# Altium schematic sheet 05.SchDoc
size 297 x 209 mm
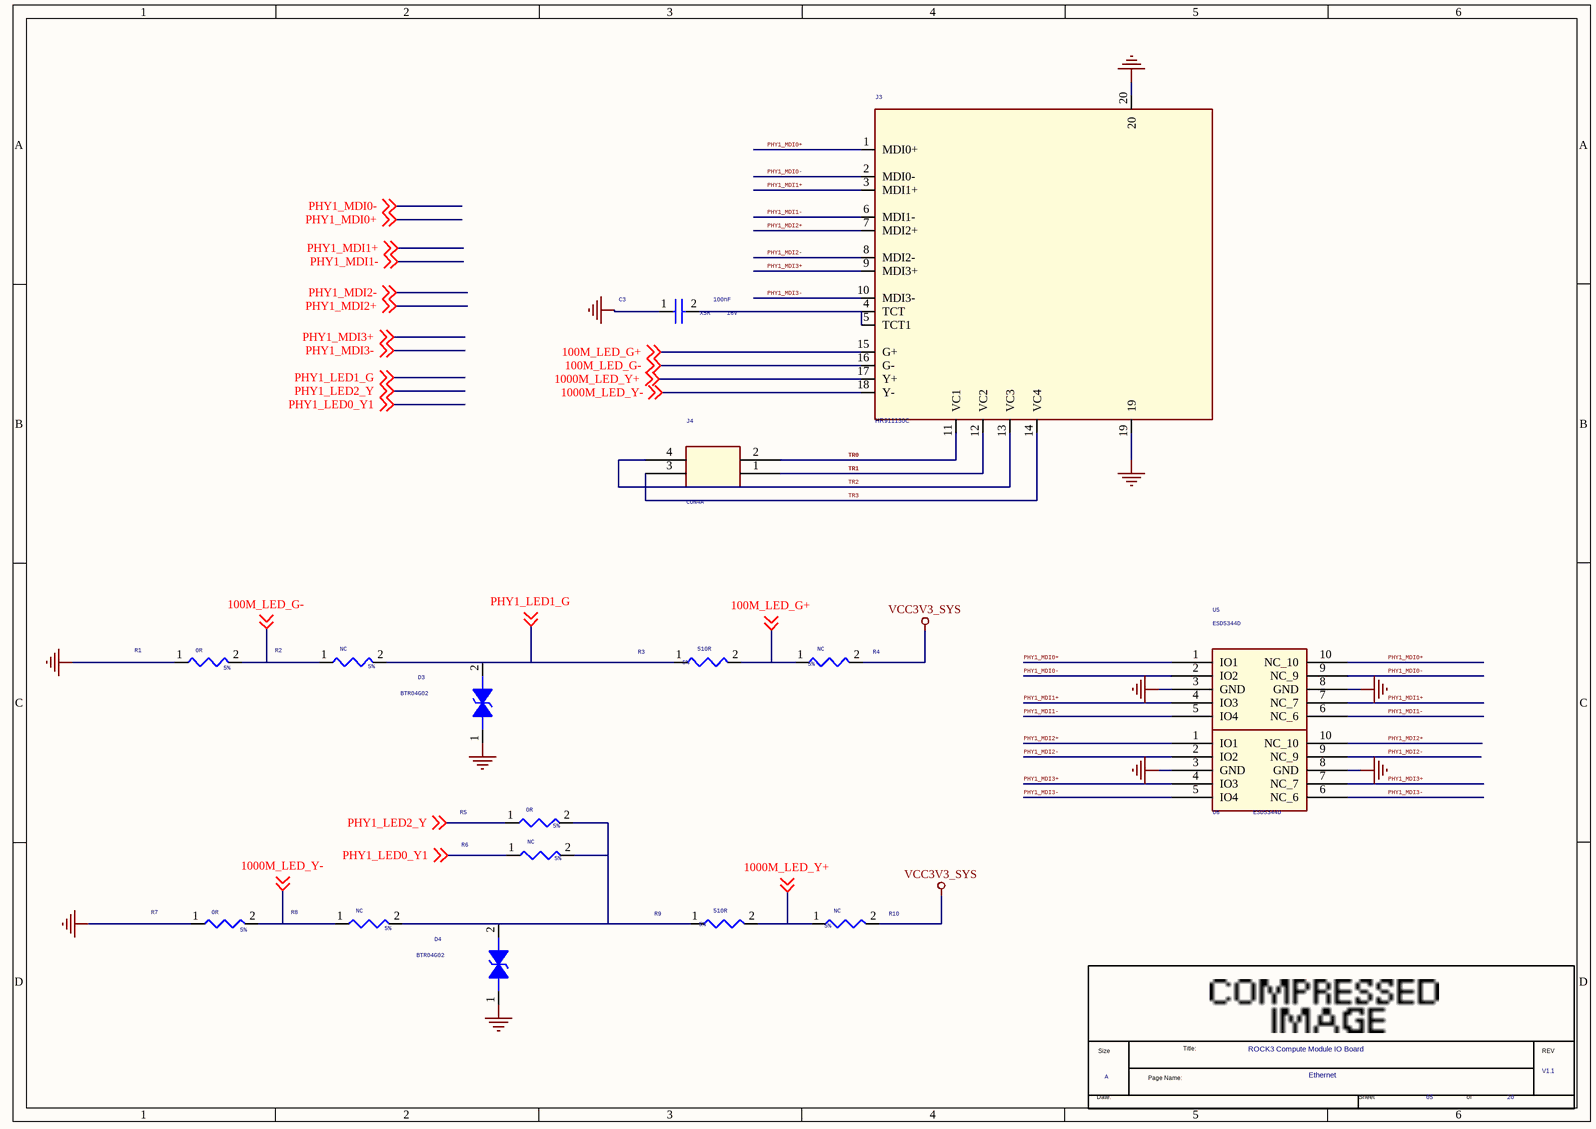
[diagram p0: 05.SchDoc]

## Parts
*  Page Count: 20  Page Number: 05  Page Size: A  Title: ROCK3 Compute Module IO Board  RevCode: V1.1  Doc: Ethernet  (hidden comment: radxa_gong)  (graphical)
C3  100nF  Voltage: 16V  Dielectric: X5R  [C0402]
D3  BTR04G02  [ESD0402_1xD5]
D4  BTR04G02  [ESD0402_1xD5]
J3  HR911130C  [RJ45_PULSE]
J4  CON4A  [DIP4PIN-2_54MM-2X2]
R1  0R  Tolerance: 5%  [R0402]
R2  NC  Tolerance: 5%  [R0402]
R3  510R  Tolerance: 5%  [R0402]
R4  NC  Tolerance: 5%  [R0402]
R5  0R  Tolerance: 5%  [R0402]
R6  NC  Tolerance: 5%  [R0402]
R7  0R  Tolerance: 5%  [R0402]
R8  NC  Tolerance: 5%  [R0402]
R9  510R  Tolerance: 5%  [R0402]
R10  NC  Tolerance: 5%  [R0402]
U5  ESD5344D  [SON10_2R50X1R00X0R50]
U6  ESD5344D  [SON10_2R50X1R00X0R50]

## Nets
GND: C3.1 D3.1 D4.1 J3.19 J3.20 R1.1 R7.1 U5.3(GND) U5.8(GND) U6.3(GND) U6.8(GND)
VCC3V3_SYS: R4.2 R10.2
100M_LED_G+: J3.15(G+) R3.2 R4.1 ; off-sheet 100M_LED_G+
100M_LED_G-: J3.16(G-) R1.2 R2.1 ; off-sheet 100M_LED_G-
1000M_LED_Y+: J3.17(Y+) R9.2 R10.1 ; off-sheet 1000M_LED_Y+
1000M_LED_Y-: J3.18(Y-) R7.2 R8.1 ; off-sheet 1000M_LED_Y-
PHY1_LED0_Y1: R6.1 ; off-sheet PHY1_LED0_Y1
PHY1_LED1_G: D3.2 R2.2 R3.1 ; off-sheet PHY1_LED1_G
PHY1_LED2_Y: R5.1 ; off-sheet PHY1_LED2_Y
PHY1_MDI0+: J3.1(MDI0+) U5.1(IO1) U5.10(NC_10) ; off-sheet PHY1_MDI0+
PHY1_MDI0-: J3.2(MDI0-) U5.2(IO2) U5.9(NC_9) ; off-sheet PHY1_MDI0-
PHY1_MDI1+: J3.3(MDI1+) U5.4(IO3) U5.7(NC_7) ; off-sheet PHY1_MDI1+
PHY1_MDI1-: J3.6(MDI1-) U5.5(IO4) U5.6(NC_6) ; off-sheet PHY1_MDI1-
PHY1_MDI2+: J3.7(MDI2+) U6.1(IO1) U6.10(NC_10) ; off-sheet PHY1_MDI2+
PHY1_MDI2-: J3.8(MDI2-) U6.2(IO2) U6.9(NC_9) ; off-sheet PHY1_MDI2-
PHY1_MDI3+: J3.9(MDI3+) U6.4(IO3) U6.7(NC_7) ; off-sheet PHY1_MDI3+
PHY1_MDI3-: J3.10(MDI3-) U6.5(IO4) U6.6(NC_6) ; off-sheet PHY1_MDI3-
TR0: J3.11(VC1) J4.2
TR1: J3.12(VC2) J4.1
TR2: J3.13(VC3) J4.4
TR3: J3.14(VC4) J4.3
NetC3_2: C3.2 J3.4(TCT) J3.5(TCT1)
NetD4_2: D4.2 R5.2 R6.2 R8.2 R9.1

## Notes on the sheet
- (in symbol radxa_gong) Size; Title:; REV; Page Name:; Date:; Sheet; of

## Library data of the parts
C3 = CAP NP_Dup2: cap,100.00nF,+/-10%,16V,X5R,C0402; Manufacturer: TDK; RK PN: C1005X5R1C104K050BA; Priority: A; Tolerance: 10%; Part Type: C0402; Manufacturer PN: C1005X5R1C104K050BA; Created by: JJJ
D3 D4 = DIODE BI_DIR TRIG: 1-Line, Bi-directional, Transient Voltage Suppressors.17.5pF.; Manufacturer PN: ESD5451N; Manufacturer: WillSemi(韦尔半导体); OPTION: DNP; Priority: A; Created by: JJJ; Part Type: ESD_TVS; RK PN: ESD5451N
J3 = HR911130C_1: 千兆网口接口，内置变压器; VAL: J00-0061; DESIG: 10/100 base TX LXT971A; BOI: RJ45; FAB: PULSE; DEV: CON_PULSE_J00-61; Priority: A; REF: J00-0061; RK PN: HR911130C; Part Type: Ethernet Jack; Manufacturer Part Number: HR911130C; Created by: JJJ
J4 = CON4A_0
R1 R5-R7 = RESISTOR_Dup1: 通用厚膜电阻,0R,+/-5%,R0402,1/16W.; Manufacturer PN: RC0402JR-070RL; Manufacturer: YAGEO; Wattage: 1/16W; Priority: A; Created by: YTL; Part Type: 通用厚膜电阻; RK PN: RC0402JR-070RL
R2 R8 = RESISTOR_Dup1: 通用厚膜电阻,0R,+/-5%,R0402,1/16W.; Manufacturer: YAGEO; RK PN: RC0402JR-070RL; Priority: A; Wattage: 1/16W; Part Type: 通用厚膜电阻; Manufacturer PN: RC0402JR-070RL; Created by: YTL
R3 R9 = RESISTOR_Dup1: 通用厚膜电阻,0R,+/-5%,R0402,1/16W.; Manufacturer: YAGEO; RK PN: RC0402JR-070RL; Priority: A; Wattage: 1/16W; option: DNP; Part Type: 通用厚膜电阻; Manufacturer PN: RC0402JR-070RL; Created by: YTL
R4 R10 = RESISTOR_Dup1: 通用厚膜电阻,510R,+/-5%,R0402,1/16W.; Manufacturer PN: RC0402JR-07510RL; Manufacturer: YAGEO; Wattage: 1/16W; Priority: A; Created by: YTL; Part Type: 通用厚膜电阻; RK PN: RC0402JR-07510RL
U5 U6 = ESD_ESD5304D: 4-Lines, Uni-directional, Ultra-low Capacitance Transient Voltage Suppressors; Manufacturer: WillSemi(韦尔半导体); Priority: A; RK PN: ESD5304D; Part Type: ESD_TVS; Manufacturer PN: ESD5304D; Created by: JJJ
* = radxa_gong: Page Create Date: March  8, 1995